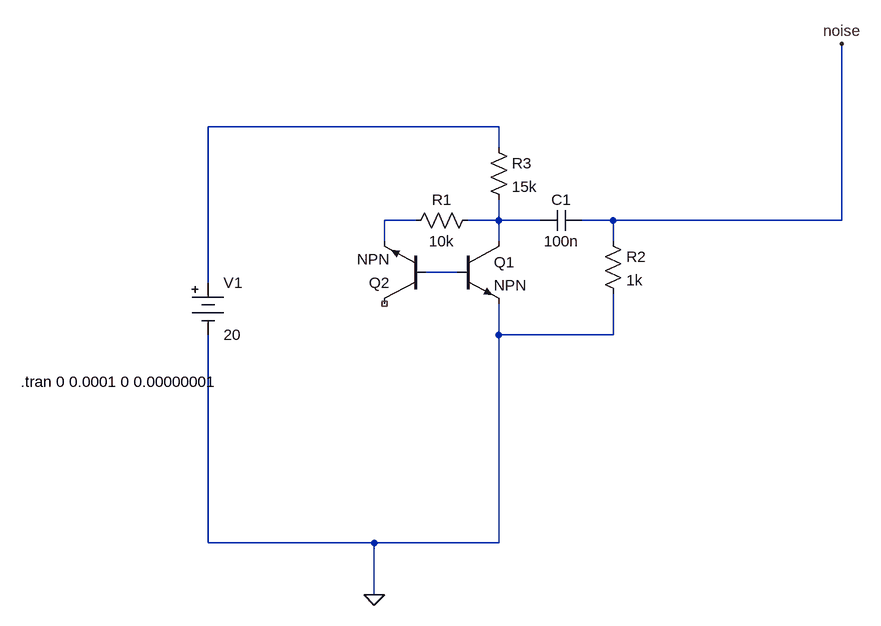
[diagram p0: schematic Noise_gen2.asc]
Noise_gen2.asc, the LTspice schematic file:
Version 4
SHEET 1 1824 680
WIRE 496 -96 48 -96
WIRE 496 -64 496 -96
WIRE 368 48 320 48
WIRE 496 48 496 16
WIRE 496 48 448 48
WIRE 560 48 496 48
WIRE 672 48 624 48
WIRE 1024 48 1024 -224
WIRE 1024 48 672 48
WIRE 320 80 320 48
WIRE 496 80 496 48
WIRE 672 80 672 48
WIRE 432 128 384 128
WIRE 48 144 48 -96
WIRE 496 224 496 176
WIRE 672 224 672 160
WIRE 672 224 496 224
WIRE 48 544 48 224
WIRE 304 544 48 544
WIRE 496 544 496 224
WIRE 496 544 304 544
WIRE 304 624 304 544
FLAG 304 624 0
FLAG 1024 -224 noise
SYMBOL Misc\\battery 48 128 R0
WINDOW 123 0 0 Left 2
WINDOW 39 0 0 Left 2
SYMATTR InstName V1
SYMATTR Value 20
SYMBOL npn 432 80 R0
SYMATTR InstName Q1
SYMBOL res 480 -80 R0
SYMATTR InstName R3
SYMATTR Value 15k
SYMBOL npn 384 176 R180
SYMATTR InstName Q2
SYMBOL res 464 32 R90
WINDOW 0 0 56 VBottom 2
WINDOW 3 32 56 VTop 2
SYMATTR InstName R1
SYMATTR Value 10k
SYMBOL cap 624 32 R90
WINDOW 0 0 32 VBottom 2
WINDOW 3 32 32 VTop 2
SYMATTR InstName C1
SYMATTR Value 100n
SYMBOL res 656 64 R0
SYMATTR InstName R2
SYMATTR Value 1k
TEXT -240 296 Left 2 !.tran 0 0.0001 0 0.00000001

The netlist it stands for:
* Noise_gen2.asc
V1 N001 0 20
Q1 N003 N004 0 0 NPN
R3 N001 N003 15k
Q2 NC_01 N004 N002 0 NPN
R1 N003 N002 10k
C1 noise N003 100n
R2 noise 0 1k
.model NPN NPN
.model PNP PNP
.lib standard.bjt
.tran 0 0.0001 0 0.00000001
.backanno
.end